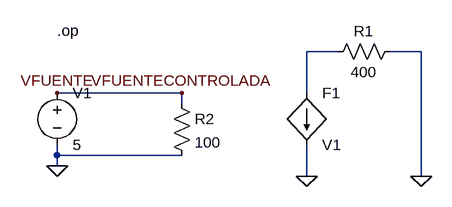
[diagram p0: schematic FTECONTROLADA CPRRIENTE.asc]
FTECONTROLADA CPRRIENTE.asc, the LTspice schematic file:
Version 4
SHEET 1 880 680
WIRE 464 48 416 48
WIRE 592 48 544 48
WIRE 224 112 32 112
WIRE 416 112 416 48
WIRE 224 128 224 112
WIRE 32 208 32 192
WIRE 224 208 32 208
WIRE 32 224 32 208
WIRE 416 240 416 192
WIRE 592 240 592 48
FLAG 32 224 0
FLAG 416 240 0
FLAG 592 240 0
FLAG 32 112 VFUENTE
FLAG 224 112 VFUENTECONTROLADA
SYMBOL voltage 32 96 R0
SYMATTR InstName V1
SYMATTR Value 5
SYMBOL res 560 32 R90
WINDOW 0 0 56 VBottom 2
WINDOW 3 32 56 VTop 2
SYMATTR InstName R1
SYMATTR Value 400
SYMBOL res 208 112 R0
SYMATTR InstName R2
SYMATTR Value 100
SYMATTR SpiceLine tol=100
SYMBOL f 416 112 R0
SYMATTR InstName F1
SYMATTR Value V1
SYMATTR Value2 2
TEXT 32 16 Left 2 !.op

The netlist it stands for:
* FTECONTROLADA CPRRIENTE.asc
V1 VFUENTECONTROLADA 0 5
R1 0 N001 400
R2 VFUENTECONTROLADA 0 100 tol=100
F1 N001 0 V1 2
.op
.backanno
.end